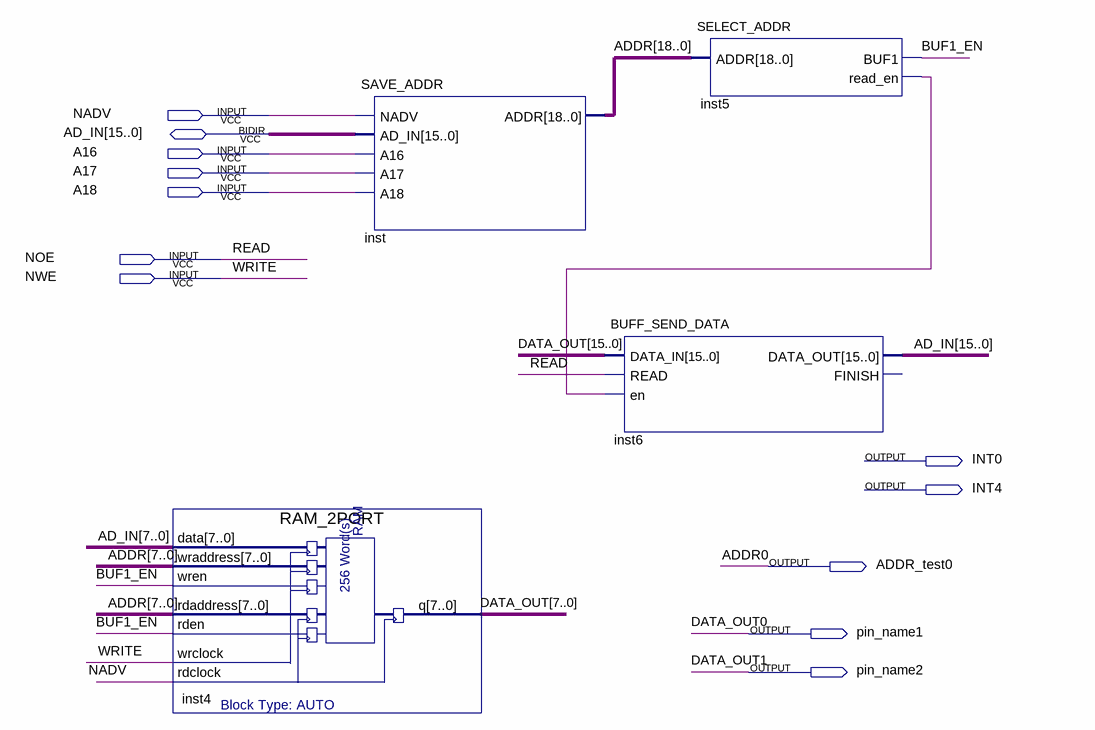
[diagram p0: schematic sheet]
// Quartus schematic FPGA_EP2C.bdf as structural Verilog: 4 symbols, 12 pins
module FPGA_EP2C (
  input  NADV,
  input  A16,
  input  A17,
  input  A18,
  input  NOE,
  input  NWE,
  inout  [15:0] AD_IN,
  output INT0,
  output INT4,
  output ADDR_test0,
  output pin_name1,
  output pin_name2
);

  wire BUF1_EN, inst5_read_en;
  wire [15:2] DATA_OUT;
  wire [18:1] ADDR;

  RAM_2PORT inst4 (
    .data(AD_IN[7:0]), .wraddress({ADDR[7:1], ADDR_test0}), .wren(BUF1_EN),
    .rdaddress({ADDR[7:1], ADDR_test0}), .rden(BUF1_EN), .wrclock(NWE), .rdclock(NADV),
    .q({DATA_OUT[7:2], pin_name2, pin_name1}));
  SAVE_ADDR inst (.NADV(NADV), .AD_IN(AD_IN), .A16(A16), .A17(A17), .A18(A18), .ADDR({ADDR, ADDR_test0}));
  BUFF_SEND_DATA inst6 (
    .DATA_IN({DATA_OUT, pin_name2, pin_name1}), .READ(NOE), .en(inst5_read_en), .DATA_OUT(AD_IN));  // open: FINISH
  SELECT_ADDR inst5 (.ADDR({ADDR, ADDR_test0}), .BUF1(BUF1_EN), .read_en(inst5_read_en));

  // Other names for the same wires on the sheet: ADDR[0] = ADDR_test0; ADDR0 = ADDR_test0;
  //   DATA_OUT[1:0] = {pin_name2, pin_name1}; DATA_OUT0 = pin_name1; DATA_OUT1 = pin_name2; READ = NOE; WRITE = NWE
endmodule
